# EasyEDA schematic Nakuja Ignition.json
TITLE: Sheet_1; REV: 1.0; Date: 2021-02-19; Sheet: 1/1; Drawn By: BrianOlasya; Company: Nakuja
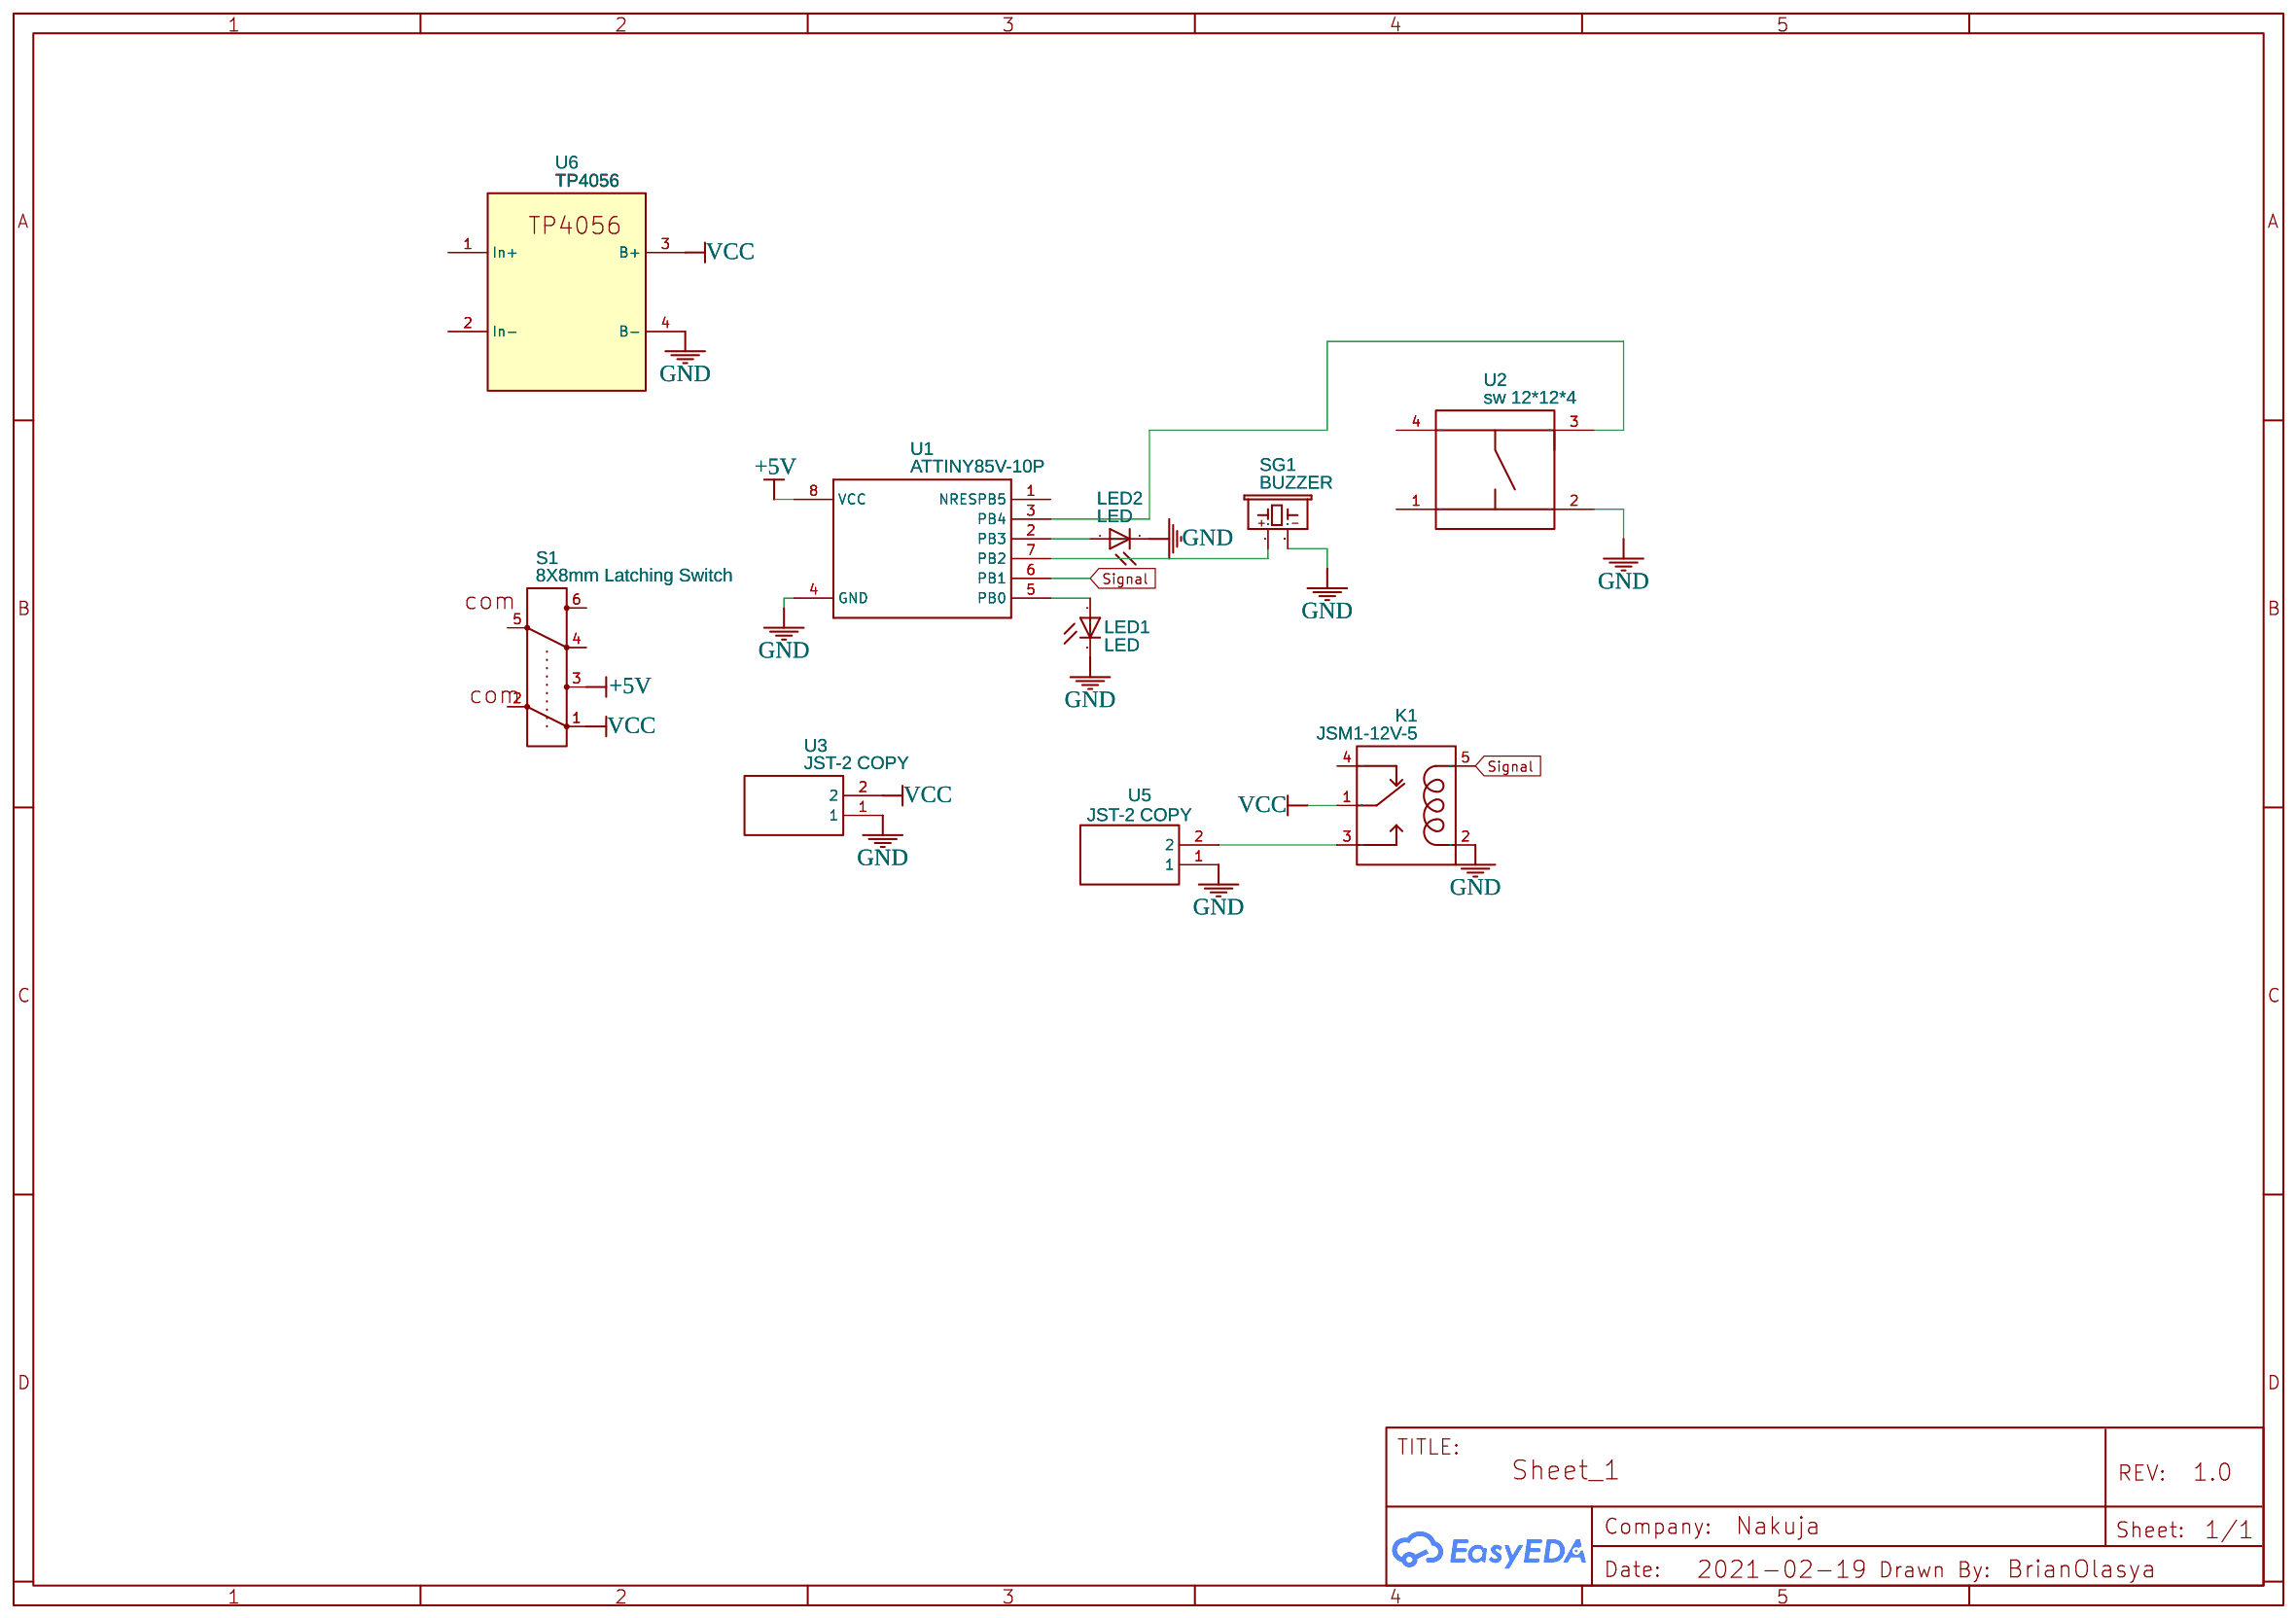
[diagram p0: schematic sheet]

## Parts
K1  JSM1-12V-5  [RELAY-TH_JSM1-X12VX]
LED1  LED  [LED5MM-KIT]
LED2  LED  [LED5MM-KIT]
S1  8X8mm Latching Switch  [8*8MM_LATCHING_SWITCH]
SG1  BUZZER  [BUZZER-HOFFMANN]
U1  ATTINY85V-10P  [PDIP08_300MIL]
U2  sw 12*12*4  [SW]
U3  JST-2 COPY  [JST_XHT-2]
U5  JST-2 COPY  [JST_XHT-2]
U6  TP4056  [TP4056]

## Library data of the parts
K1 = JSM1-12V-5: Supplier: LCSC; Supplier Part: C148306; Manufacturer: PANASONIC; Contributor: LCSC
LED1 LED2 = LED
S1 = 8X8mm Latching Switch: Manufacturer Part: New SchematicLib; Contributor: kimonn
SG1 = BUZZER: Contributor: SparkFun
U1 = ATTINY85V-10P
U2 = sw 12*12*4: Manufacturer Part: sw; Contributor: samwel09
U3 U5 = JST-2 COPY: Manufacturer Part: JST-s-PTH; Contributor: arielbernal
U6 = TP4056: Contributor: fernandolopes38

## Nets
+5V: S1.3 U1.8(VCC)
GND: K1.2(COIL2) LED1.K(C) LED2.K(C) SG1.2 U1.4(GND) U2.2 U3.1 U5.1 U6.4(B-)
VCC: K1.1(C) S1.1 U3.2 U6.3(B+)
Signal: K1.5(COIL1) U1.6(PB1)
Net-(K1-3): K1.3(NO) U5.2
Net-(LED1-A): LED1.A U1.5(PB0)
Net-(LED2-A): LED2.A U1.2(PB3)
Net-(SG1-1): SG1.1 U1.7(PB2)
Net-(U1-3): U1.3(PB4) U2.3

Not connected (* = marked no-connect by the designer): K1 4(NC); S1 2 4 5 6; U1 1(NRESPB5); U2 1 4; U6 1(In+) 2(In-)
